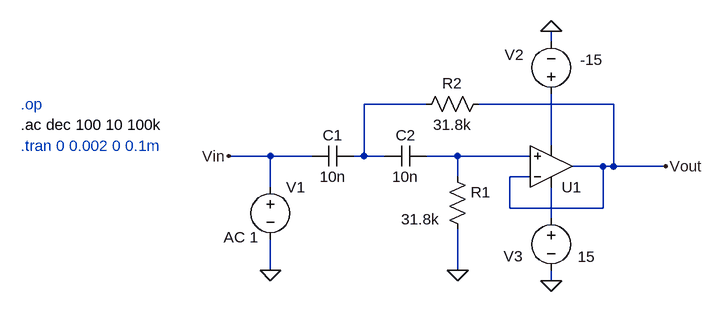
[diagram p0: schematic Active 2nd order HPF.asc]
Active 2nd order HPF.asc, the LTspice schematic file:
Version 4.1
SHEET 1 880 680
WIRE 496 -80 496 -96
WIRE 304 16 208 16
WIRE 592 16 384 16
WIRE 496 80 496 0
WIRE 64 96 0 96
WIRE 128 96 64 96
WIRE 208 96 208 16
WIRE 208 96 192 96
WIRE 240 96 208 96
WIRE 352 96 304 96
WIRE 464 96 352 96
WIRE 576 112 528 112
WIRE 592 112 592 16
WIRE 592 112 576 112
WIRE 672 112 592 112
WIRE 352 128 352 96
WIRE 464 128 432 128
WIRE 64 144 64 96
WIRE 432 176 432 128
WIRE 576 176 576 112
WIRE 576 176 432 176
WIRE 496 192 496 144
WIRE 64 272 64 224
WIRE 352 272 352 208
WIRE 496 288 496 272
FLAG 0 96 Vin
FLAG 64 272 0
FLAG 496 288 0
FLAG 496 -96 0
FLAG 352 272 0
FLAG 672 112 Vout
SYMBOL cap 192 80 R90
WINDOW 0 0 32 VBottom 2
WINDOW 3 32 32 VTop 2
SYMATTR InstName C1
SYMATTR Value 10n
SYMBOL cap 304 80 R90
WINDOW 0 0 32 VBottom 2
WINDOW 3 32 32 VTop 2
SYMATTR InstName C2
SYMATTR Value 10n
SYMBOL res 336 112 R0
WINDOW 3 -71 81 Left 2
SYMATTR Value 31.8k
SYMATTR InstName R1
SYMBOL res 400 0 R90
WINDOW 0 0 56 VBottom 2
WINDOW 3 32 56 VTop 2
SYMATTR InstName R2
SYMATTR Value 31.8k
SYMBOL voltage 64 128 R0
WINDOW 3 -218 70 Left 2
WINDOW 123 -72 93 Left 2
WINDOW 39 0 0 Left 0
SYMATTR Value ""
SYMATTR Value2 AC 1
SYMATTR InstName V1
SYMBOL voltage 496 16 R180
WINDOW 0 42 76 Left 2
WINDOW 3 -80 68 Left 2
WINDOW 123 0 0 Left 0
WINDOW 39 0 0 Left 0
SYMATTR InstName V2
SYMATTR Value -15
SYMBOL voltage 496 176 R0
WINDOW 0 -73 74 Left 2
WINDOW 3 41 75 Left 2
WINDOW 123 0 0 Left 0
WINDOW 39 0 0 Left 0
SYMATTR InstName V3
SYMATTR Value 15
SYMBOL OpAmps\\UniversalOpAmp2 496 112 M180
SYMATTR InstName U1
TEXT -320 16 Left 2 ;.op
TEXT -320 48 Left 2 !.ac dec 100 10 100k
TEXT -320 80 Left 2 ;.tran 0 0.002 0 0.1m

The netlist it stands for:
* Active 2nd order HPF.asc
C1 N001 Vin 10n
C2 N003 N001 10n
R1 N003 0 31.8k
R2 Vout N001 31.8k
V1 Vin 0 AC 1
V2 N002 0 -15
V3 N004 0 15
X§U1 N003 Vout N004 N002 Vout level2 Avol=1Meg GBW=10Meg Slew=10Meg Ilimit=25m Rail=0 Vos=0 En=0 Enk=0 In=0 Ink=0 Rin=500Meg  ; pins In+ In- V+ V- OUT
* .op
.ac dec 100 10 100k
* .tran 0 0.002 0 0.1m
.lib UniversalOpAmp2.lib
.backanno
.end